# Altium schematic sheet POWER_MS.SchDoc
size A3
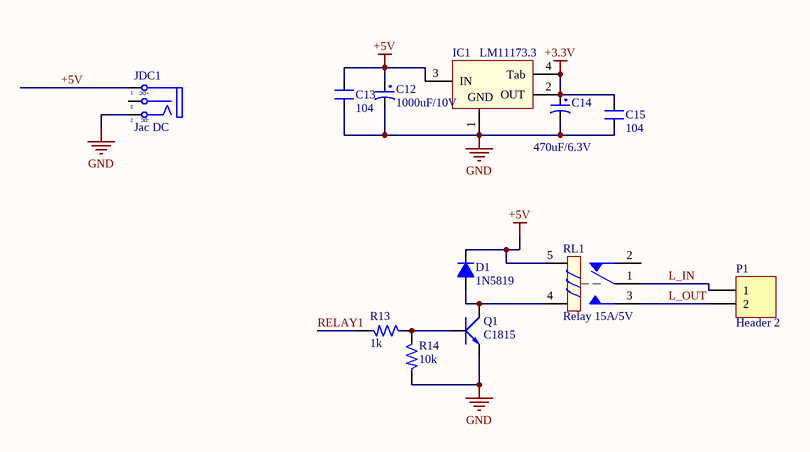
[diagram p0: POWER_MS.SchDoc]

## Parts
C12  1000uF/10V  [CP1.5/3.4]
C13  104  [C0603]
C14  470uF/6.3V  [CP1/2]
C15  104  [C0603]
D1  1N5819  [DO-214AC]
IC1  LM11173.3  [SOT223-4N]
JDC1  Jac DC  [DC-IN]
P1  Header 2  [HDR1X2]
Q1  C1815  [SOT23B]
R13  1k  [R0603]
R14  10k  [R0603]
RL1  Relay 15A/5V  [HF32F-JZC-32F]

## Nets
+3.3V: C14.1 C15.2 IC1.2(OUT) IC1.4(Tab)
+5V: C12.1 C13.2 D1.2(K) IC1.3(IN) JDC1.1(T) RL1.5
GND: C12.2 C13.1 C14.2 C15.1 IC1.1(ADJ/G) JDC1.2(TN) Q1.1(E) R14.2
L_IN: P1.1 RL1.1
L_OUT: P1.2 RL1.3
RELAY1: R13.2
NetD1_1: D1.1(A) Q1.2(C) RL1.4
NetQ1_3: Q1.3(B) R13.1 R14.1

Not connected (* = marked no-connect by the designer): JDC1 3(S); RL1 2

## Notes on the sheet
- (in symbol DCIN) +DC; -DC
- (in symbol LM1117) GND

## Library data of the parts
C12 C14 = CP1: Cap P  0,1uF < 22uF , 16 - 50V; Value: 10uF/50V; Description 1: 10 => 220uF/6,3V/10V - 10uF => 100uF/16V; Description 2: 0,1uF => 33uF/50V - 10uF => 22uF/63V; Description 3: 0,47uF => 10uF/100V
C13 C15 = CAP: Cremic For Xtal 1pF => 100pF; Value: 33pF
D1 = D1A: Diode 1A; Value: 1N4007
IC1 = LM1117: 3v3; Value: LM317
JDC1 = DCIN: Jac DC input; Value: Jac DC
P1 = Header 2: Header, 2-Pin; LatestRevisionDate: 17-Jul-2002; LatestRevisionNote: Re-released for DXP Platform.; Publisher: Altium Limited
Q1 = C1815: NPN 600mW, ECB; Value: C1815
R13 R14 = R: Resistor 1/4W; Value: R1/4W - 1K
RL1 = Relay 1: Relay SPDT,10A - 12VDC 5 Pin; Value: Relay SPDT, 10A, 12V